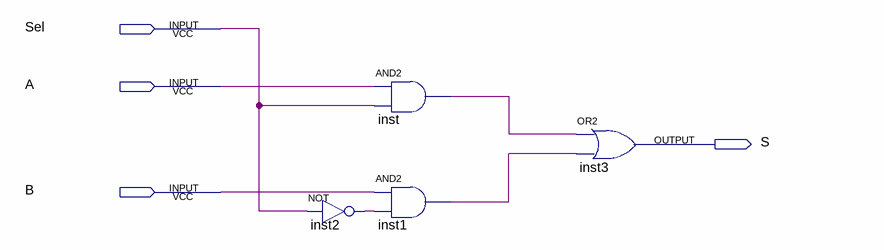
[diagram p0: schematic sheet]
// Quartus schematic Teste.bdf as structural Verilog: 4 symbols, 4 pins
module Teste (
  input  Sel,
  input  A,
  input  B,
  output S
);

  wire inst1_out, inst2_out, inst_out;

  and inst (inst_out, A, Sel);
  and inst1 (inst1_out, B, inst2_out);
  not inst2 (inst2_out, Sel);
  or inst3 (S, inst_out, inst1_out);
endmodule
